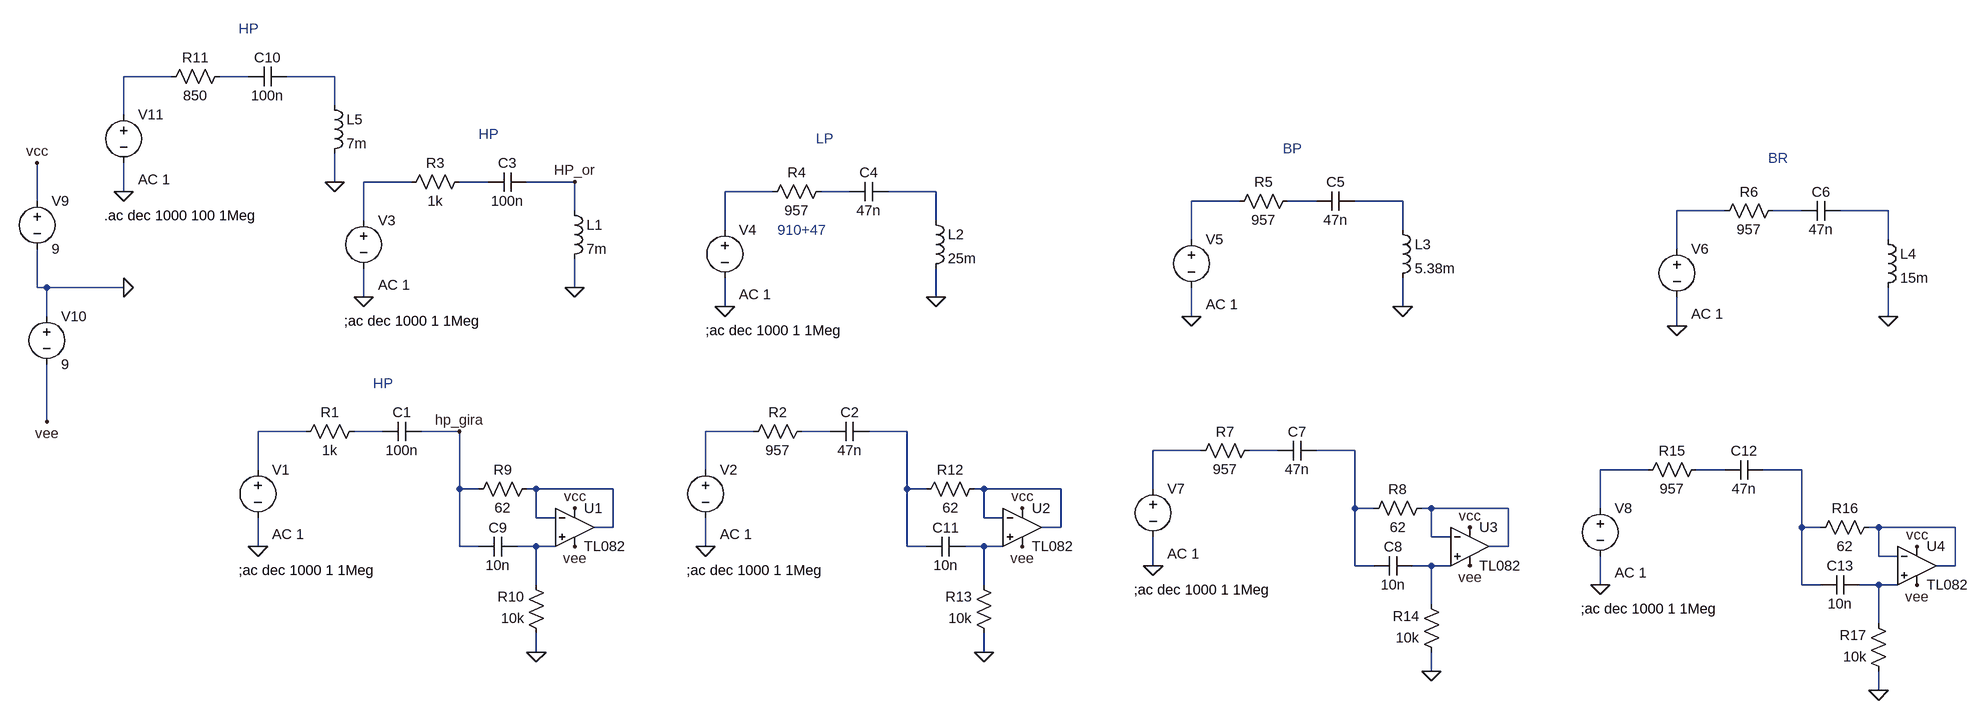
[diagram p0: schematic Draft1.asc]
Draft1.asc, the LTspice schematic file:
Version 4
SHEET 1 4128 964
WIRE 784 -80 704 -80
WIRE 912 -80 864 -80
WIRE 1056 -80 976 -80
WIRE 1056 -32 1056 -80
WIRE 704 -16 704 -80
WIRE 1056 96 1056 48
WIRE 1184 96 1104 96
WIRE 1312 96 1264 96
WIRE 1456 96 1376 96
WIRE 704 112 704 64
WIRE 1888 112 1808 112
WIRE 2016 112 1968 112
WIRE 2160 112 2080 112
WIRE 560 128 560 64
WIRE 2816 128 2736 128
WIRE 2944 128 2896 128
WIRE 3088 128 3008 128
WIRE 1456 144 1456 96
WIRE 3712 144 3632 144
WIRE 3840 144 3792 144
WIRE 3984 144 3904 144
WIRE 1104 160 1104 96
WIRE 2160 160 2160 112
WIRE 1808 176 1808 112
WIRE 3088 176 3088 128
WIRE 2736 192 2736 128
WIRE 3984 192 3984 144
WIRE 3632 208 3632 144
WIRE 560 272 560 208
WIRE 576 272 560 272
WIRE 704 272 576 272
WIRE 1456 272 1456 224
WIRE 1104 288 1104 240
WIRE 2160 288 2160 240
WIRE 1808 304 1808 256
WIRE 3088 304 3088 256
WIRE 576 320 576 272
WIRE 2736 320 2736 272
WIRE 3984 320 3984 272
WIRE 3632 336 3632 288
WIRE 576 496 576 400
WIRE 1008 512 928 512
WIRE 1136 512 1088 512
WIRE 1264 512 1200 512
WIRE 1856 512 1776 512
WIRE 1984 512 1936 512
WIRE 2112 512 2048 512
WIRE 2752 544 2672 544
WIRE 2880 544 2832 544
WIRE 3008 544 2944 544
WIRE 928 576 928 512
WIRE 1776 576 1776 512
WIRE 3584 576 3504 576
WIRE 3712 576 3664 576
WIRE 3840 576 3776 576
WIRE 1264 608 1264 512
WIRE 1296 608 1264 608
WIRE 1392 608 1376 608
WIRE 1520 608 1392 608
WIRE 2112 608 2112 512
WIRE 2144 608 2112 608
WIRE 2240 608 2224 608
WIRE 2368 608 2240 608
WIRE 2672 608 2672 544
WIRE 3008 640 3008 544
WIRE 3040 640 3008 640
WIRE 3136 640 3120 640
WIRE 3264 640 3136 640
WIRE 3504 640 3504 576
WIRE 1392 656 1392 608
WIRE 1424 656 1392 656
WIRE 2240 656 2240 608
WIRE 2272 656 2240 656
WIRE 1520 672 1520 608
WIRE 1520 672 1488 672
WIRE 2368 672 2368 608
WIRE 2368 672 2336 672
WIRE 3840 672 3840 576
WIRE 3872 672 3840 672
WIRE 3968 672 3952 672
WIRE 4096 672 3968 672
WIRE 3136 688 3136 640
WIRE 3168 688 3136 688
WIRE 928 704 928 656
WIRE 1264 704 1264 608
WIRE 1296 704 1264 704
WIRE 1392 704 1360 704
WIRE 1424 704 1424 688
WIRE 1424 704 1392 704
WIRE 1776 704 1776 656
WIRE 2112 704 2112 608
WIRE 2144 704 2112 704
WIRE 2240 704 2208 704
WIRE 2272 704 2272 688
WIRE 2272 704 2240 704
WIRE 3264 704 3264 640
WIRE 3264 704 3232 704
WIRE 3968 720 3968 672
WIRE 4000 720 3968 720
WIRE 2672 736 2672 688
WIRE 3008 736 3008 640
WIRE 3040 736 3008 736
WIRE 3136 736 3104 736
WIRE 3168 736 3168 720
WIRE 3168 736 3136 736
WIRE 4096 736 4096 672
WIRE 4096 736 4064 736
WIRE 1392 768 1392 704
WIRE 2240 768 2240 704
WIRE 3504 768 3504 720
WIRE 3840 768 3840 672
WIRE 3872 768 3840 768
WIRE 3968 768 3936 768
WIRE 4000 768 4000 752
WIRE 4000 768 3968 768
WIRE 3136 800 3136 736
WIRE 3968 832 3968 768
WIRE 1392 880 1392 848
WIRE 2240 880 2240 848
WIRE 3136 912 3136 880
WIRE 3968 944 3968 912
FLAG 1104 288 0
FLAG 1456 272 0
FLAG 1808 304 0
FLAG 2160 288 0
FLAG 2736 320 0
FLAG 3088 304 0
FLAG 3632 336 0
FLAG 3984 320 0
FLAG 928 704 0
FLAG 704 272 0
FLAG 560 64 vcc
FLAG 576 496 vee
FLAG 1456 640 vcc
FLAG 1456 704 vee
FLAG 1392 880 0
FLAG 704 112 0
FLAG 1056 96 0
FLAG 1456 96 HP_or
FLAG 1264 512 hp_gira
FLAG 1776 704 0
FLAG 2304 640 vcc
FLAG 2304 704 vee
FLAG 2240 880 0
FLAG 2672 736 0
FLAG 3200 672 vcc
FLAG 3200 736 vee
FLAG 3136 912 0
FLAG 3504 768 0
FLAG 4032 704 vcc
FLAG 4032 768 vee
FLAG 3968 944 0
SYMBOL res 1168 112 R270
WINDOW 0 32 56 VTop 2
WINDOW 3 0 56 VBottom 2
SYMATTR InstName R3
SYMATTR Value 1k
SYMBOL cap 1376 80 R90
WINDOW 0 0 32 VBottom 2
WINDOW 3 32 32 VTop 2
SYMATTR InstName C3
SYMATTR Value 100n
SYMBOL voltage 1104 144 R0
WINDOW 123 24 124 Left 2
WINDOW 39 0 0 Left 0
SYMATTR Value2 AC 1
SYMATTR InstName V3
SYMATTR Value ""
SYMBOL ind 1440 128 R0
SYMATTR InstName L1
SYMATTR Value 7m
SYMBOL res 1872 128 R270
WINDOW 0 32 56 VTop 2
WINDOW 3 0 56 VBottom 2
SYMATTR InstName R4
SYMATTR Value 957
SYMBOL cap 2080 96 R90
WINDOW 0 0 32 VBottom 2
WINDOW 3 32 32 VTop 2
SYMATTR InstName C4
SYMATTR Value 47n
SYMBOL voltage 1808 160 R0
WINDOW 123 24 124 Left 2
WINDOW 39 0 0 Left 0
SYMATTR Value2 AC 1
SYMATTR InstName V4
SYMATTR Value ""
SYMBOL ind 2144 144 R0
SYMATTR InstName L2
SYMATTR Value 25m
SYMBOL res 2800 144 R270
WINDOW 0 32 56 VTop 2
WINDOW 3 0 56 VBottom 2
SYMATTR InstName R5
SYMATTR Value 957
SYMBOL cap 3008 112 R90
WINDOW 0 0 32 VBottom 2
WINDOW 3 32 32 VTop 2
SYMATTR InstName C5
SYMATTR Value 47n
SYMBOL voltage 2736 176 R0
WINDOW 123 24 124 Left 2
WINDOW 39 0 0 Left 0
SYMATTR Value2 AC 1
SYMATTR InstName V5
SYMATTR Value ""
SYMBOL ind 3072 160 R0
SYMATTR InstName L3
SYMATTR Value 5.38m
SYMBOL res 3696 160 R270
WINDOW 0 32 56 VTop 2
WINDOW 3 0 56 VBottom 2
SYMATTR InstName R6
SYMATTR Value 957
SYMBOL cap 3904 128 R90
WINDOW 0 0 32 VBottom 2
WINDOW 3 32 32 VTop 2
SYMATTR InstName C6
SYMATTR Value 47n
SYMBOL voltage 3632 192 R0
WINDOW 123 24 124 Left 2
WINDOW 39 0 0 Left 0
SYMATTR Value2 AC 1
SYMATTR InstName V6
SYMATTR Value ""
SYMBOL ind 3968 176 R0
SYMATTR InstName L4
SYMATTR Value 15m
SYMBOL res 992 528 R270
WINDOW 0 32 56 VTop 2
WINDOW 3 0 56 VBottom 2
SYMATTR InstName R1
SYMATTR Value 1k
SYMBOL cap 1200 496 R90
WINDOW 0 0 32 VBottom 2
WINDOW 3 32 32 VTop 2
SYMATTR InstName C1
SYMATTR Value 100n
SYMBOL voltage 928 560 R0
WINDOW 123 24 124 Left 2
WINDOW 39 0 0 Left 0
SYMATTR Value2 AC 1
SYMATTR InstName V1
SYMATTR Value ""
SYMBOL Germosymb\\TL082 1456 672 R0
SYMATTR InstName U1
SYMBOL voltage 560 112 R0
WINDOW 123 0 0 Left 0
WINDOW 39 0 0 Left 0
SYMATTR InstName V9
SYMATTR Value 9
SYMBOL voltage 576 304 R0
WINDOW 123 0 0 Left 0
WINDOW 39 0 0 Left 0
SYMATTR InstName V10
SYMATTR Value 9
SYMBOL res 1392 592 R90
WINDOW 0 0 56 VBottom 2
WINDOW 3 32 56 VTop 2
SYMATTR InstName R9
SYMATTR Value 62
SYMBOL res 1408 864 R180
WINDOW 0 36 76 Left 2
WINDOW 3 36 40 Left 2
SYMATTR InstName R10
SYMATTR Value 10k
SYMBOL cap 1360 688 R90
WINDOW 0 0 32 VBottom 2
WINDOW 3 32 32 VTop 2
SYMATTR InstName C9
SYMATTR Value 10n
SYMBOL res 768 -64 R270
WINDOW 0 32 56 VTop 2
WINDOW 3 0 56 VBottom 2
SYMATTR InstName R11
SYMATTR Value 850
SYMBOL cap 976 -96 R90
WINDOW 0 0 32 VBottom 2
WINDOW 3 32 32 VTop 2
SYMATTR InstName C10
SYMATTR Value 100n
SYMBOL voltage 704 -32 R0
WINDOW 123 24 124 Left 2
WINDOW 39 0 0 Left 0
SYMATTR Value2 AC 1
SYMATTR InstName V11
SYMATTR Value ""
SYMBOL ind 1040 -48 R0
SYMATTR InstName L5
SYMATTR Value 7m
SYMBOL res 1840 528 R270
WINDOW 0 32 56 VTop 2
WINDOW 3 0 56 VBottom 2
SYMATTR InstName R2
SYMATTR Value 957
SYMBOL cap 2048 496 R90
WINDOW 0 0 32 VBottom 2
WINDOW 3 32 32 VTop 2
SYMATTR InstName C2
SYMATTR Value 47n
SYMBOL voltage 1776 560 R0
WINDOW 123 24 124 Left 2
WINDOW 39 0 0 Left 0
SYMATTR Value2 AC 1
SYMATTR InstName V2
SYMATTR Value ""
SYMBOL Germosymb\\TL082 2304 672 R0
SYMATTR InstName U2
SYMBOL res 2240 592 R90
WINDOW 0 0 56 VBottom 2
WINDOW 3 32 56 VTop 2
SYMATTR InstName R12
SYMATTR Value 62
SYMBOL res 2256 864 R180
WINDOW 0 36 76 Left 2
WINDOW 3 36 40 Left 2
SYMATTR InstName R13
SYMATTR Value 10k
SYMBOL cap 2208 688 R90
WINDOW 0 0 32 VBottom 2
WINDOW 3 32 32 VTop 2
SYMATTR InstName C11
SYMATTR Value 10n
SYMBOL res 2736 560 R270
WINDOW 0 32 56 VTop 2
WINDOW 3 0 56 VBottom 2
SYMATTR InstName R7
SYMATTR Value 957
SYMBOL cap 2944 528 R90
WINDOW 0 0 32 VBottom 2
WINDOW 3 32 32 VTop 2
SYMATTR InstName C7
SYMATTR Value 47n
SYMBOL voltage 2672 592 R0
WINDOW 123 24 124 Left 2
WINDOW 39 0 0 Left 0
SYMATTR Value2 AC 1
SYMATTR InstName V7
SYMATTR Value ""
SYMBOL Germosymb\\TL082 3200 704 R0
SYMATTR InstName U3
SYMBOL res 3136 624 R90
WINDOW 0 0 56 VBottom 2
WINDOW 3 32 56 VTop 2
SYMATTR InstName R8
SYMATTR Value 62
SYMBOL res 3152 896 R180
WINDOW 0 36 76 Left 2
WINDOW 3 36 40 Left 2
SYMATTR InstName R14
SYMATTR Value 10k
SYMBOL cap 3104 720 R90
WINDOW 0 0 32 VBottom 2
WINDOW 3 32 32 VTop 2
SYMATTR InstName C8
SYMATTR Value 10n
SYMBOL res 3568 592 R270
WINDOW 0 32 56 VTop 2
WINDOW 3 0 56 VBottom 2
SYMATTR InstName R15
SYMATTR Value 957
SYMBOL cap 3776 560 R90
WINDOW 0 0 32 VBottom 2
WINDOW 3 32 32 VTop 2
SYMATTR InstName C12
SYMATTR Value 47n
SYMBOL voltage 3504 624 R0
WINDOW 123 24 124 Left 2
WINDOW 39 0 0 Left 0
SYMATTR Value2 AC 1
SYMATTR InstName V8
SYMATTR Value ""
SYMBOL Germosymb\\TL082 4032 736 R0
SYMATTR InstName U4
SYMBOL res 3968 656 R90
WINDOW 0 0 56 VBottom 2
WINDOW 3 32 56 VTop 2
SYMATTR InstName R16
SYMATTR Value 62
SYMBOL res 3984 928 R180
WINDOW 0 36 76 Left 2
WINDOW 3 36 40 Left 2
SYMATTR InstName R17
SYMATTR Value 10k
SYMBOL cap 3936 752 R90
WINDOW 0 0 32 VBottom 2
WINDOW 3 32 32 VTop 2
SYMATTR InstName C13
SYMATTR Value 10n
TEXT 1072 328 Left 2 !;ac dec 1000 1 1Meg
TEXT 1296 16 Left 2 ;HP
TEXT 1776 344 Left 2 !;ac dec 1000 1 1Meg
TEXT 1960 24 Left 2 ;LP
TEXT 1896 176 Left 2 ;910+47
TEXT 2888 40 Left 2 ;BP
TEXT 3784 56 Left 2 ;BR
TEXT 896 744 Left 2 !;ac dec 1000 1 1Meg
TEXT 1120 432 Left 2 ;HP
TEXT 672 152 Left 2 !.ac dec 1000 100 1Meg
TEXT 896 -160 Left 2 ;HP
TEXT 1744 744 Left 2 !;ac dec 1000 1 1Meg
TEXT 2640 776 Left 2 !;ac dec 1000 1 1Meg
TEXT 3472 808 Left 2 !;ac dec 1000 1 1Meg

The netlist it stands for:
* Draft1.asc
R3 N004 N005 1k
C3 HP_or N005 100n
V3 N004 0 AC 1
L1 HP_or 0 7m
R4 N006 N007 957
C4 N008 N007 47n
V4 N006 0 AC 1
L2 N008 0 25m
R5 N009 N010 957
C5 N011 N010 47n
V5 N009 0 AC 1
L3 N011 0 5.38m
R6 N012 N013 957
C6 N014 N013 47n
V6 N012 0 AC 1
L4 N014 0 15m
R1 N015 N016 1k
C1 hp_gira N016 100n
V1 N015 0 AC 1
* U1: TL082 (symbol Germosymb\TL082 not available, pins judged from their places): In+=N030 In-=N026 V+=vcc V-=vee OUT=N026
V9 vcc 0 9
V10 0 vee 9
R9 N026 hp_gira 62
R10 0 N030 10k
C9 N030 hp_gira 10n
R11 N001 N002 850
C10 N003 N002 100n
V11 N001 0 AC 1
L5 N003 0 7m
R2 N017 N018 957
C2 N019 N018 47n
V2 N017 0 AC 1
* U2: TL082 (symbol Germosymb\TL082 not available, pins judged from their places): In+=N031 In-=N027 V+=vcc V-=vee OUT=N027
R12 N027 N019 62
R13 0 N031 10k
C11 N031 N019 10n
R7 N020 N021 957
C7 N022 N021 47n
V7 N020 0 AC 1
* U3: TL082 (symbol Germosymb\TL082 not available, pins judged from their places): In+=N032 In-=N028 V+=vcc V-=vee OUT=N028
R8 N028 N022 62
R14 0 N032 10k
C8 N032 N022 10n
R15 N023 N024 957
C12 N025 N024 47n
V8 N023 0 AC 1
* U4: TL082 (symbol Germosymb\TL082 not available, pins judged from their places): In+=N033 In-=N029 V+=vcc V-=vee OUT=N029
R16 N029 N025 62
R17 0 N033 10k
C13 N033 N025 10n
;ac dec 1000 1 1Meg
* HP
;ac dec 1000 1 1Meg
* LP
* 910+47
* BP
* BR
;ac dec 1000 1 1Meg
* HP
.ac dec 1000 100 1Meg
* HP
;ac dec 1000 1 1Meg
;ac dec 1000 1 1Meg
;ac dec 1000 1 1Meg
.backanno
.end